# Altium schematic sheet FPGA_Core.SchDoc
size C; SheetNumber: 3; SheetTotal: 4
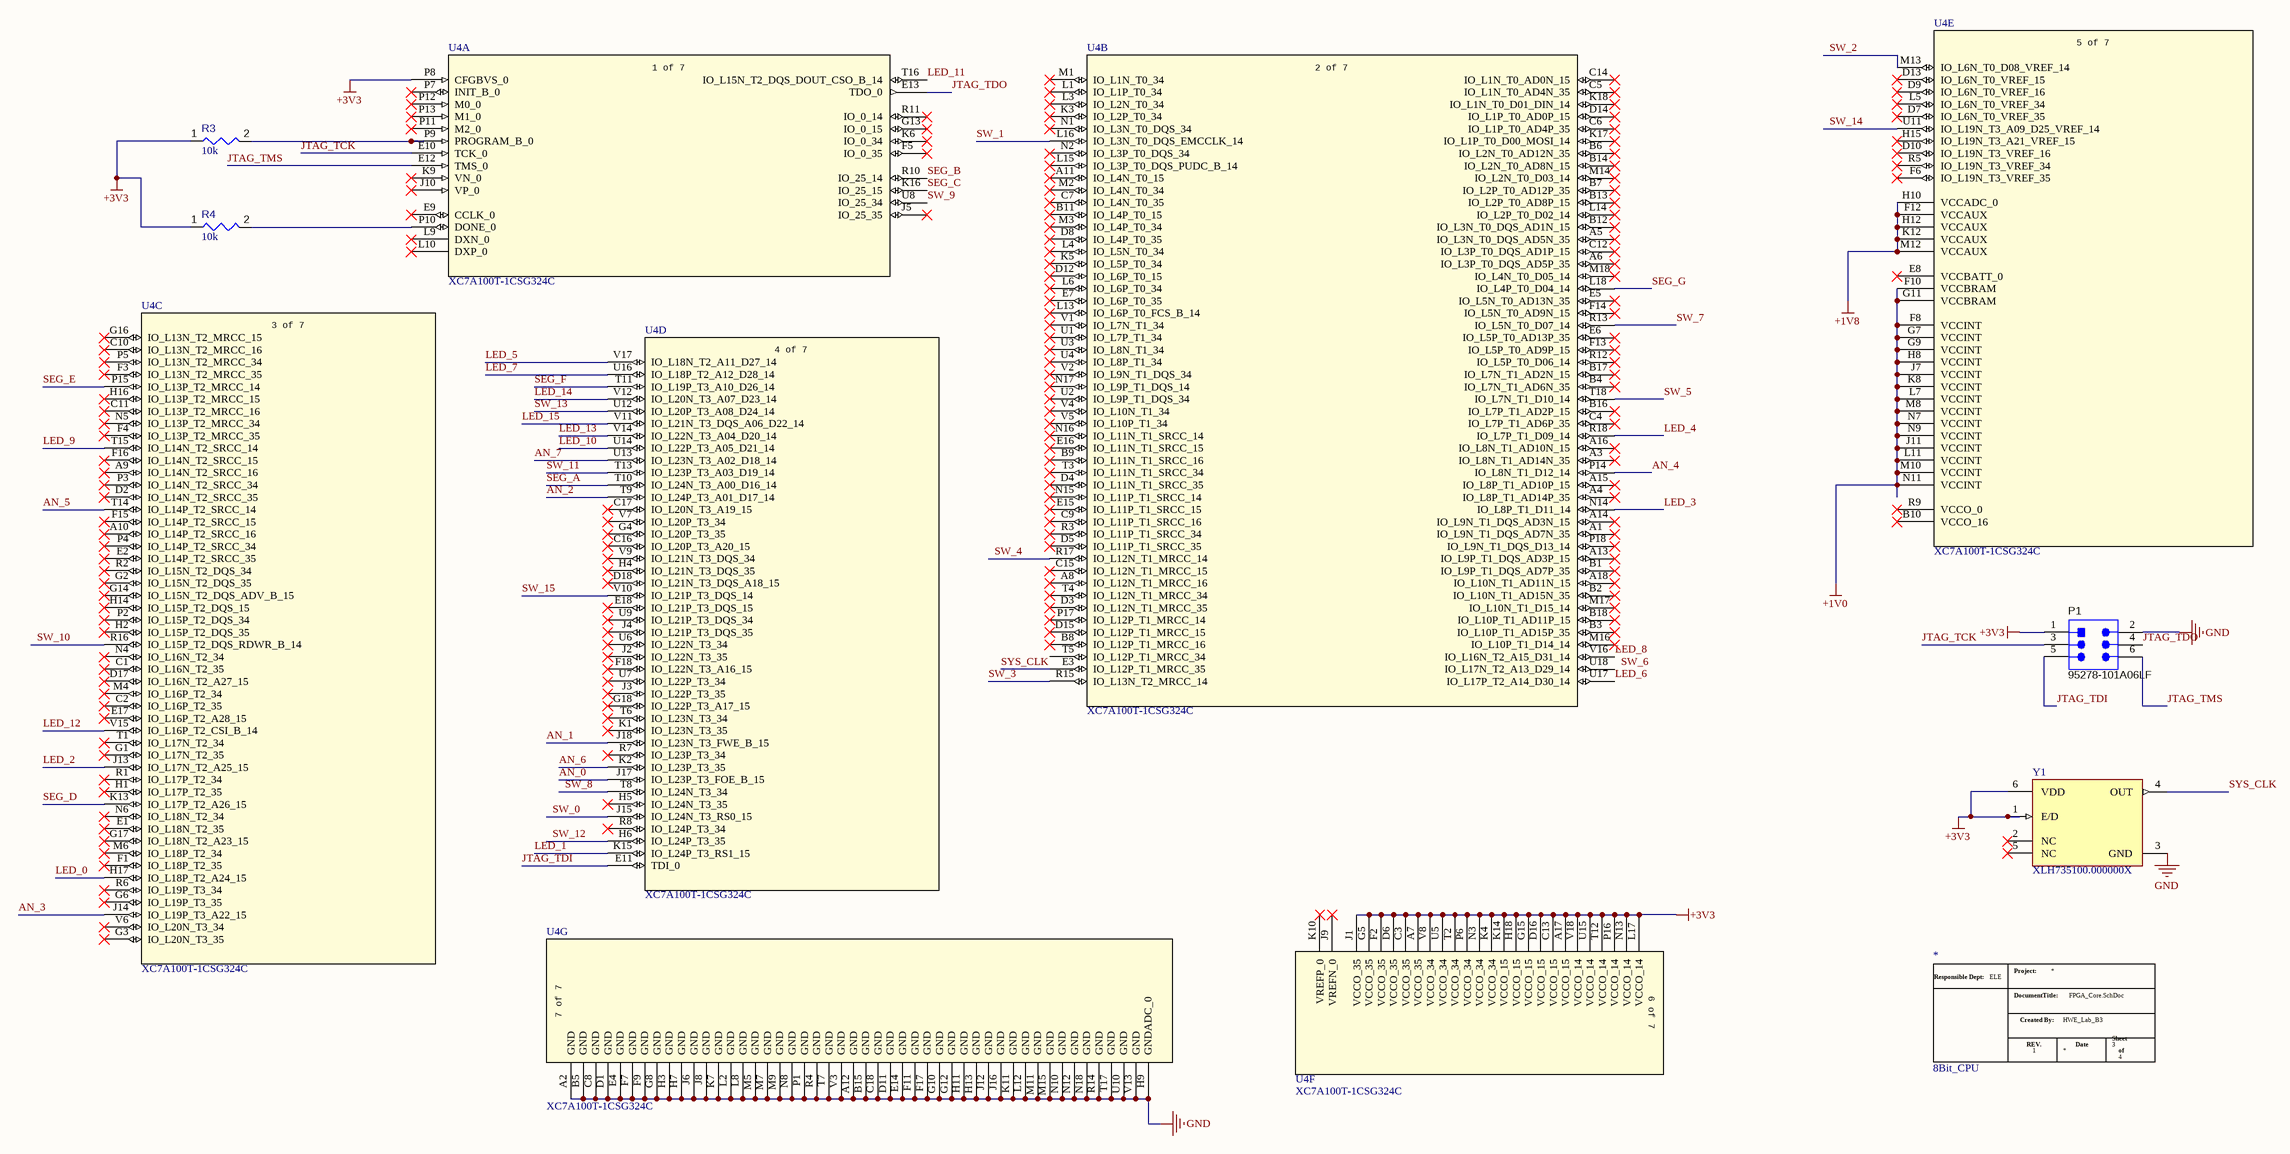
[diagram p0: FPGA_Core.SchDoc]

## Parts
*  8Bit_CPU  (graphical)
P1  95278-101A06LF  [AMPM-95278-101A06LF_V]
R3  value 10k  [RESC0402(1005)_L]  (hidden comment: 10KR2F)
R4  value 10k  [RESC0402(1005)_L]  (hidden comment: 10KR2F)
U4  XC7A100T-1CSG324C  [CSG324_XIL]  (parts A,B,C,D,E,F,G of 7)
Y1  XLH735100.000000X  [JU6_MFG]

## Nets
+1V0: U4.F8(VCCINT) U4.F10(VCCBRAM) U4.G7(VCCINT) U4.G9(VCCINT) U4.G11(VCCBRAM) U4.H8(VCCINT) U4.J7(VCCINT) U4.J11(VCCINT) U4.K8(VCCINT) U4.L7(VCCINT) U4.L11(VCCINT) U4.M8(VCCINT) U4.M10(VCCINT) U4.N7(VCCINT) U4.N9(VCCINT) U4.N11(VCCINT)
+1V8: U4.F12(VCCAUX) U4.H10(VCCADC_0) U4.H12(VCCAUX) U4.K12(VCCAUX) U4.M12(VCCAUX)
+3V3: P1.1 R3.1 R4.1 U4.A7(VCCO_35) U4.A17(VCCO_15) U4.C3(VCCO_35) U4.C13(VCCO_15) U4.D6(VCCO_35) U4.D16(VCCO_15) U4.F2(VCCO_35) U4.G5(VCCO_35) U4.G15(VCCO_15) U4.H18(VCCO_15) U4.J1(VCCO_35) U4.K4(VCCO_34) U4.K14(VCCO_15) U4.L17(VCCO_14) U4.N3(VCCO_34) U4.N13(VCCO_14) U4.P6(VCCO_34) U4.P8(CFGBVS_0) U4.P16(VCCO_14) U4.T2(VCCO_34) U4.T12(VCCO_14) U4.U5(VCCO_34) U4.U15(VCCO_14) U4.V8(VCCO_34) U4.V18(VCCO_14) Y1.1(E/D) Y1.6(VDD)
GND: P1.2 U4.A2(GND) U4.A12(GND) U4.B5(GND) U4.B15(GND) U4.C8(GND) U4.C18(GND) U4.D1(GND) U4.D11(GND) U4.E4(GND) U4.E14(GND) U4.F7(GND) U4.F9(GND) U4.F11(GND) U4.F17(GND) U4.G8(GND) U4.G10(GND) U4.G12(GND) U4.H3(GND) U4.H7(GND) U4.H9(GNDADC_0) U4.H11(GND) U4.H13(GND) U4.J6(GND) U4.J8(GND) U4.J12(GND) U4.J16(GND) U4.K7(GND) U4.K11(GND) U4.L2(GND) U4.L8(GND) U4.L12(GND) U4.M5(GND) U4.M7(GND) U4.M9(GND) U4.M11(GND) U4.M15(GND) U4.N8(GND) U4.N10(GND) U4.N12(GND) U4.N18(GND) U4.P1(GND) U4.R4(GND) U4.R14(GND) U4.T7(GND) U4.T17(GND) U4.U10(GND) U4.V3(GND) U4.V13(GND) Y1.3(GND)
  SW_0: U4.J15(IO_L24N_T3_RS0_15)
  SW_2: U4.M13(IO_L6N_T0_D08_VREF_14)
  SW_4: U4.R17(IO_L12N_T1_MRCC_14)
  SW_6: U4.U18(IO_L17N_T2_A13_D29_14)
  SW_8: U4.T8(IO_L24N_T3_34)
  SW_10: U4.R16(IO_L15P_T2_DQS_RDWR_B_14)
  SW_12: U4.H6(IO_L24P_T3_35)
  SW_14: U4.U11(IO_L19N_T3_A09_D25_VREF_14)
AN_0: U4.J17(IO_L23P_T3_FOE_B_15)
AN_1: U4.J18(IO_L23N_T3_FWE_B_15)
AN_2: U4.T9(IO_L24P_T3_A01_D17_14)
AN_3: U4.J14(IO_L19P_T3_A22_15)
AN_4: U4.P14(IO_L8N_T1_D12_14)
AN_5: U4.T14(IO_L14P_T2_SRCC_14)
AN_6: U4.K2(IO_L23P_T3_35)
AN_7: U4.U13(IO_L23N_T3_A02_D18_14)
JTAG_TCK: P1.3 U4.E10(TCK_0)
JTAG_TDI: P1.5 U4.E11(TDI_0)
JTAG_TDO: P1.4 U4.E13(TDO_0)
JTAG_TMS: P1.6 U4.E12(TMS_0)
LED_0: U4.H17(IO_L18P_T2_A24_15)
LED_1: U4.K15(IO_L24P_T3_RS1_15)
LED_2: U4.J13(IO_L17N_T2_A25_15)
LED_3: U4.N14(IO_L8P_T1_D11_14)
LED_4: U4.R18(IO_L7P_T1_D09_14)
LED_5: U4.V17(IO_L18N_T2_A11_D27_14)
LED_6: U4.U17(IO_L17P_T2_A14_D30_14)
LED_7: U4.U16(IO_L18P_T2_A12_D28_14)
LED_8: U4.V16(IO_L16N_T2_A15_D31_14)
LED_9: U4.T15(IO_L14N_T2_SRCC_14)
LED_10: U4.U14(IO_L22P_T3_A05_D21_14)
LED_11: U4.T16(IO_L15N_T2_DQS_DOUT_CSO_B_14)
LED_12: U4.V15(IO_L16P_T2_CSI_B_14)
LED_13: U4.V14(IO_L22N_T3_A04_D20_14)
LED_14: U4.V12(IO_L20N_T3_A07_D23_14)
LED_15: U4.V11(IO_L21N_T3_DQS_A06_D22_14)
SEG_A: U4.T10(IO_L24N_T3_A00_D16_14)
SEG_B: U4.R10(IO_25_14)
SEG_C: U4.K16(IO_25_15)
SEG_D: U4.K13(IO_L17P_T2_A26_15)
SEG_E: U4.P15(IO_L13P_T2_MRCC_14)
SEG_F: U4.T11(IO_L19P_T3_A10_D26_14)
SEG_G: U4.L18(IO_L4P_T0_D04_14)
SW_1: U4.L16(IO_L3N_T0_DQS_EMCCLK_14)
SW_3: U4.R15(IO_L13N_T2_MRCC_14)
SW_5: U4.T18(IO_L7N_T1_D10_14)
SW_7: U4.R13(IO_L5N_T0_D07_14)
SW_9: U4.U8(IO_25_34)
SW_11: U4.T13(IO_L23P_T3_A03_D19_14)
SW_13: U4.U12(IO_L20P_T3_A08_D24_14)
SW_15: U4.V10(IO_L21P_T3_DQS_14)
SYS_CLK: U4.E3(IO_L12P_T1_MRCC_35) Y1.4(OUT)
NetR3_2: R3.2 U4.P9(PROGRAM_B_0)
NetR4_2: R4.2 U4.P10(DONE_0)

Not connected (* = marked no-connect by the designer): U4 A1(IO_L9N_T1_DQS_AD7N_35)* A3(IO_L8N_T1_AD14N_35)* A4(IO_L8P_T1_AD14P_35)* A5(IO_L3N_T0_DQS_AD5N_35)* A6(IO_L3P_T0_DQS_AD5P_35)* A8(IO_L12N_T1_MRCC_16)* A9(IO_L14N_T2_SRCC_16)* A10(IO_L14P_T2_SRCC_16)* A11(IO_L4N_T0_15)* A13(IO_L9P_T1_DQS_AD3P_15)* A14(IO_L9N_T1_DQS_AD3N_15)* A15(IO_L8P_T1_AD10P_15)* A16(IO_L8N_T1_AD10N_15)* A18(IO_L10N_T1_AD11N_15)* B1(IO_L9P_T1_DQS_AD7P_35)* B2(IO_L10N_T1_AD15N_35)* B3(IO_L10P_T1_AD15P_35)* B4(IO_L7N_T1_AD6N_35)* B6(IO_L2N_T0_AD12N_35)* B7(IO_L2P_T0_AD12P_35)* B8(IO_L12P_T1_MRCC_16)* B9(IO_L11N_T1_SRCC_16)* B10(VCCO_16)* B11(IO_L4P_T0_15)* B12(IO_L3N_T0_DQS_AD1N_15)* B13(IO_L2P_T0_AD8P_15)* B14(IO_L2N_T0_AD8N_15)* B16(IO_L7P_T1_AD2P_15)* B17(IO_L7N_T1_AD2N_15)* B18(IO_L10P_T1_AD11P_15)* C1(IO_L16N_T2_35)* C2(IO_L16P_T2_35)* C4(IO_L7P_T1_AD6P_35)* C5(IO_L1N_T0_AD4N_35)* C6(IO_L1P_T0_AD4P_35)* C7(IO_L4N_T0_35)* C9(IO_L11P_T1_SRCC_16)* C10(IO_L13N_T2_MRCC_16)* C11(IO_L13P_T2_MRCC_16)* C12(IO_L3P_T0_DQS_AD1P_15)* C14(IO_L1N_T0_AD0N_15)* C15(IO_L12N_T1_MRCC_15)* C16(IO_L20P_T3_A20_15)* C17(IO_L20N_T3_A19_15)* D2(IO_L14N_T2_SRCC_35)* D3(IO_L12N_T1_MRCC_35)* D4(IO_L11N_T1_SRCC_35)* D5(IO_L11P_T1_SRCC_35)* D7(IO_L6N_T0_VREF_35)* D8(IO_L4P_T0_35)* D9(IO_L6N_T0_VREF_16)* D10(IO_L19N_T3_VREF_16)* D12(IO_L6P_T0_15)* D13(IO_L6N_T0_VREF_15)* D14(IO_L1P_T0_AD0P_15)* D15(IO_L12P_T1_MRCC_15)* D17(IO_L16N_T2_A27_15)* D18(IO_L21N_T3_DQS_A18_15)* E1(IO_L18N_T2_35)* E2(IO_L14P_T2_SRCC_35)* E5(IO_L5N_T0_AD13N_35)* E6(IO_L5P_T0_AD13P_35)* E7(IO_L6P_T0_35)* E8(VCCBATT_0)* E9(CCLK_0)* E15(IO_L11P_T1_SRCC_15)* E16(IO_L11N_T1_SRCC_15)* E17(IO_L16P_T2_A28_15)* E18(IO_L21P_T3_DQS_15)* F1(IO_L18P_T2_35)* F3(IO_L13N_T2_MRCC_35)* F4(IO_L13P_T2_MRCC_35)* F5(IO_0_35)* F6(IO_L19N_T3_VREF_35)* F13(IO_L5P_T0_AD9P_15)* F14(IO_L5N_T0_AD9N_15)* F15(IO_L14P_T2_SRCC_15)* F16(IO_L14N_T2_SRCC_15)* F18(IO_L22N_T3_A16_15)* G1(IO_L17N_T2_35)* G2(IO_L15N_T2_DQS_35)* G3(IO_L20N_T3_35)* G4(IO_L20P_T3_35)* G6(IO_L19P_T3_35)* G13(IO_0_15)* G14(IO_L15N_T2_DQS_ADV_B_15)* G16(IO_L13N_T2_MRCC_15)* G17(IO_L18N_T2_A23_15)* G18(IO_L22P_T3_A17_15)* H1(IO_L17P_T2_35)* H2(IO_L15P_T2_DQS_35)* H4(IO_L21N_T3_DQS_35)* H5(IO_L24N_T3_35)* H14(IO_L15P_T2_DQS_15)* H15(IO_L19N_T3_A21_VREF_15)* H16(IO_L13P_T2_MRCC_15)* J2(IO_L22N_T3_35)* J3(IO_L22P_T3_35)* J4(IO_L21P_T3_DQS_35)* J5(IO_25_35)* J9(VREFN_0)* J10(VP_0)* K1(IO_L23N_T3_35)* K3(IO_L2P_T0_34)* K5(IO_L5P_T0_34)* K6(IO_0_34)* K9(VN_0)* K10(VREFP_0)* K17(IO_L1P_T0_D00_MOSI_14)* K18(IO_L1N_T0_D01_DIN_14)* L1(IO_L1P_T0_34)* L3(IO_L2N_T0_34)* L4(IO_L5N_T0_34)* L5(IO_L6N_T0_VREF_34)* L6(IO_L6P_T0_34)* L9(DXN_0)* L10(DXP_0)* L13(IO_L6P_T0_FCS_B_14)* L14(IO_L2P_T0_D02_14)* L15(IO_L3P_T0_DQS_PUDC_B_14)* M1(IO_L1N_T0_34)* M2(IO_L4N_T0_34)* M3(IO_L4P_T0_34)* M4(IO_L16P_T2_34)* M6(IO_L18P_T2_34)* M14(IO_L2N_T0_D03_14)* M16(IO_L10P_T1_D14_14)* M17(IO_L10N_T1_D15_14)* M18(IO_L4N_T0_D05_14)* N1(IO_L3N_T0_DQS_34)* N2(IO_L3P_T0_DQS_34)* N4(IO_L16N_T2_34)* N5(IO_L13P_T2_MRCC_34)* N6(IO_L18N_T2_34)* N15(IO_L11P_T1_SRCC_14)* N16(IO_L11N_T1_SRCC_14)* N17(IO_L9P_T1_DQS_14)* P2(IO_L15P_T2_DQS_34)* P3(IO_L14N_T2_SRCC_34)* P4(IO_L14P_T2_SRCC_34)* P5(IO_L13N_T2_MRCC_34)* P7(INIT_B_0)* P11(M2_0)* P12(M0_0)* P13(M1_0)* P17(IO_L12P_T1_MRCC_14)* P18(IO_L9N_T1_DQS_D13_14)* R1(IO_L17P_T2_34)* R2(IO_L15N_T2_DQS_34)* R3(IO_L11P_T1_SRCC_34)* R5(IO_L19N_T3_VREF_34)* R6(IO_L19P_T3_34)* R7(IO_L23P_T3_34)* R8(IO_L24P_T3_34)* R9(VCCO_0)* R11(IO_0_14)* R12(IO_L5P_T0_D06_14)* T1(IO_L17N_T2_34)* T3(IO_L11N_T1_SRCC_34)* T4(IO_L12N_T1_MRCC_34)* T5(IO_L12P_T1_MRCC_34) T6(IO_L23N_T3_34)* U1(IO_L7P_T1_34)* U2(IO_L9P_T1_DQS_34)* U3(IO_L8N_T1_34)* U4(IO_L8P_T1_34)* U6(IO_L22N_T3_34)* U7(IO_L22P_T3_34)* U9(IO_L21P_T3_DQS_34)* V1(IO_L7N_T1_34)* V2(IO_L9N_T1_DQS_34)* V4(IO_L10N_T1_34)* V5(IO_L10P_T1_34)* V6(IO_L20N_T3_34)* V7(IO_L20P_T3_34)* V9(IO_L21N_T3_DQS_34)*; Y1 2(NC)* 5(NC)*

## Notes on the sheet
- (in symbol 8Bit_CPU) Project:; Responsible Dept:; ELE; DocumentTitle:; Created By:; HWE_Lab_B3; Sheet; REV.; Date; 1; of
- (in symbol XC7A100T-1CSG324C, part A) 1 of 7
- (in symbol XC7A100T-1CSG324C, part B) 2 of 7
- (in symbol XC7A100T-1CSG324C, part C) 3 of 7
- (in symbol XC7A100T-1CSG324C, part D) 4 of 7
- (in symbol XC7A100T-1CSG324C, part E) 5 of 7
- (in symbol XC7A100T-1CSG324C, part F) 6 of 7
- (in symbol XC7A100T-1CSG324C, part G) 7 of 7

## Library data of the parts
P1 = CMP-002-00024-2: Male Header, Pitch 2.54 mm, 2 x 3 Position, Height 14.4 mm, RoHS, Tape and Reel; Manufacturer: Amphenol; Package Reference: 95278-101A06LF; Package Description: Male Header, Pitch 2.54 mm, 2 x 3 Position, Height 14.4 mm; RoHS Compliant: Unknown; Case/Package: 95278-101A06LF; Connector Type: Header; Mounting Technology: SM; Gender: Male; Datasheet URL: http://portal.fciconnect.com/Comergent//fci/drawing/95278.pdf; Datasheet Version: Rev. AC, 03/2016
R3 R4 = CMP-009-00066-2: 10K 0.063W 1% 0402 (1005 Metric)  SMD; Power: 63mW; Case/Package: 0402; Mounting Technology: SMT; Pins: 2; Tolerance: 1%
U4 = XC7A100T-1CSG324C: Description; Manufacturer_Name: Xilinx Inc; Copyright: Copyright (C) 2025 Ultra Librarian. All rights reserved.; Manufacturer_Part_Number: XC7A100T-1CSG324C; RefDes: RefDes; Type: Type
Y1 = CMP-00572-106941302-3: Crystal ROHS3Compliant Enable/Disable Active Oscillator -20C~70C 47mA 0.055 1.40mm 100MHz; Max Output Frequency: 999.9MHz; Min Input Voltage: 3.135V; Output Type: LVCMOS; Max Input Voltage: 3.465V; ComponentLink1Description: Manufacturer's Website; ComponentLink2URL: https://octopart.com/cad-content/api/get-model-datasheet/15189/106941302; Case/Package: CLCC; Number of Pins: 6; Mount: Surface Mount; ComponentLink2Description: Datasheet URL; Min Operating Temperature: -20°C; HelpURL: https://octopart.com/cad-content/api/get-model-datasheet/15189/106941302; ComponentLink3Description: Manufacturer's Package Drawing; RoHS: Compliant; ComponentLink3URL: https://www.renesas.com/en/document/psc/ju6-package-outline-70-x-50-mm-body-13-mm-thick; Height: 1.45mm; Max Operating Temperature: 70°C; ComponentLink1URL: http://www.renesas.com